# Altium project Nucleo Shield.PrjPcb
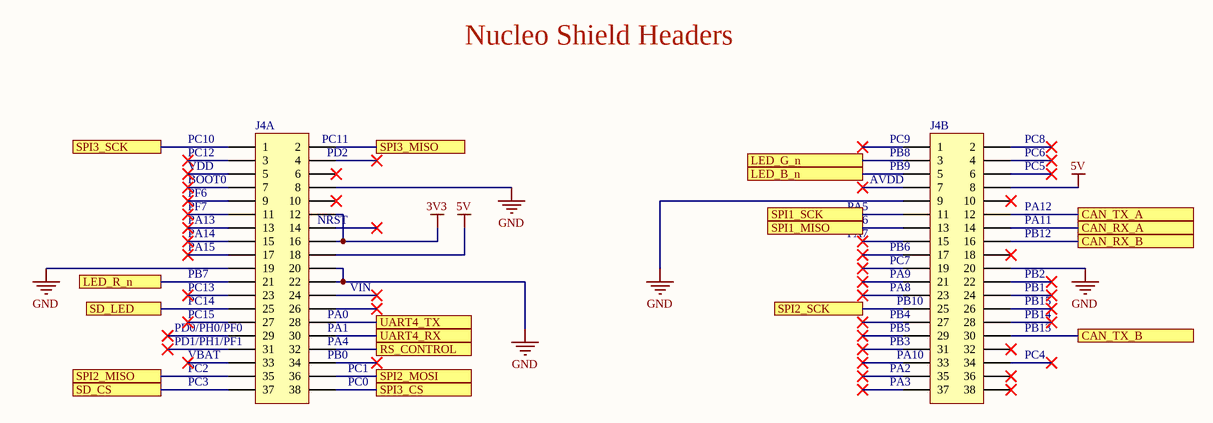
[diagram p0: SH1 - NUCLEO HEADERS.SchDoc]
6 sheets, 39 parts. Net scope: flat (ports and power ports of the same name join across sheets).
Board file: Nucleo Shield.PcbDoc
Sheets:
  SH1 - NUCLEO HEADERS.SchDoc
  SH2 - CAN.SchDoc
  SH3 - RS-485.SchDoc
  SH4 - SD CARD.SchDoc
  SH5 - RGB LED.SchDoc
  SH6 - BROADCOM ENCODER.SchDoc

## Sheet SH1 - NUCLEO HEADERS.SchDoc: Nucleo Headers
size B; CheckedBy: Wolfgang Windholtz; Engineer: Sahil Kale; Revision: 1; SheetNumber: 1; SheetTotal: 6

### Parts
J4  HEADER_NUCLEO  [HEADER_NUCLEO]  (value not drawn)  (parts A,B of 2)

### Ports
CAN_RX_A, CAN_RX_B, CAN_TX_A, CAN_TX_B, LED_B_n, LED_G_n, LED_R_n, RS_CONTROL, SD_CS, SD_LED, SPI1_MISO, SPI1_SCK, SPI2_MISO, SPI2_MOSI, SPI2_SCK, SPI3_CS, SPI3_MISO, SPI3_SCK, UART4_RX, UART4_TX

### Nets
3V3: J4.12 J4.16
5V: J4.18 J4.46(8)
GND: J4.8 J4.19 J4.20 J4.22 J4.47(9) J4.58(20)
NetJ3_1: J4.37 ; port SD_CS
NetJ3_2: J4.36 ; port SPI2_MOSI
NetJ3_5: J4.63(25) ; port SPI2_SCK
NetJ3_7: J4.35 ; port SPI2_MISO
NetJ4_1: J4.1 ; port SPI3_SCK
NetJ4_2: J4.2 ; port SPI3_MISO
NetJ4_21: J4.21 ; port LED_R_n
NetJ4_25: J4.25 ; port SD_LED
NetJ4_28: J4.28 ; port UART4_TX
NetJ4_30: J4.30 ; port UART4_RX
NetJ4_32: J4.32 ; port RS_CONTROL
NetJ4_38: J4.38 ; port SPI3_CS
NetJ4_41: J4.41(3) ; port LED_G_n
NetJ4_43: J4.43(5) ; port LED_B_n
NetJ4_49: J4.49(11) ; port SPI1_SCK
NetJ4_50: J4.50(12) ; port CAN_TX_A
NetJ4_51: J4.51(13) ; port SPI1_MISO
NetJ4_52: J4.52(14) ; port CAN_RX_A
NetJ4_54: J4.54(16) ; port CAN_RX_B
NetJ4_68: J4.68(30) ; port CAN_TX_B

Not connected (* = marked no-connect by the designer): J4 3* 4* 5* 6* 7* 9* 10* 11* 13* 14* 15* 17* 23* 24* 26* 27* 29* 31* 33* 34* 39(1)* 40(2)* 42(4)* 44(6)* 45(7)* 48(10)* 53(15)* 55(17)* 56(18)* 57(19)* 59(21)* 60(22)* 61(23)* 62(24)* 64(26)* 65(27)* 66(28)* 67(29)* 69(31)* 70(32)* 71(33)* 72(34)* 73(35)* 74(36)* 75(37)* 76(38)*

### Notes on the sheet
- Nucleo Shield Headers
- (near J4) PC10
- (near J4) PC12
- (near J4) BOOT0
- (near J4) VDD
- (near J4) PC11
- (near J4) PD2
- (near J4) AVDD
- (near J4) PC9
- (near J4) PB8
- (near J4) PB9
- (near J4) PC8
- (near J4) PC6
- (near J4) PC5
- (near J4) PF7
- (near J4) PF6
- (near J4) PA13
- (near J4) PA14
- (near J4) NRST
- (near J4) PA5
- (near J4) PA6
- (near J4) PA7
- (near J4) PA12
- (near J4) PA11
- (near J4) PB12
- (near J4) PA15
- (near J4) PB7
- (near J4) PC13
- (near J4) PC14
- (near J4) PC15
- (near J4) PA0
- (near J4) VIN
- (near J4) PB6
- (near J4) PC7
- (near J4) PA9
- (near J4) PA8
- (near J4) PB4
- (near J4) PB10
- (near J4) PB1
- (near J4) PB2
- (near J4) PB15
- (near J4) PB14
- (near J4) PD0/PH0/PF0
- (near J4) PD1/PH1/PF1
- (near J4) PC2
- (near J4) VBAT
- (near J4) PA1
- (near J4) PA4
- (near J4) PB0
- (near J4) PC1
- (near J4) PB5
- (near J4) PB3
- (near J4) PA2
- (near J4) PA10
- (near J4) PC4
- (near J4) PB13
- (near J4) PC3
- (near J4) PC0
- (near J4) PA3
- Title:
- Project:
- Date:
- Rev:
- Checker:
- Engineer:
- Sheet:
- of

### Library data of the parts
J4 = HEADER_NUCLEO: CONN HDR 38POS 0.1 GOLD PCB; Manufacturer 1: Sullins; Manufacturer Part Number 1: PPPC192LFBN-RC; Package/Footprint: TH; Supplier 1: Digi-Key; Supplier Part Number 1: S7122-ND; Mounting Type: TH; Verified: No; LCSC Part #: *

## Sheet SH2 - CAN.SchDoc: CAN Transceivers
size B; CheckedBy: Wolfgang Windholtz; Engineer: Sahil Kale; Revision: 1; SheetNumber: 2; SheetTotal: 6
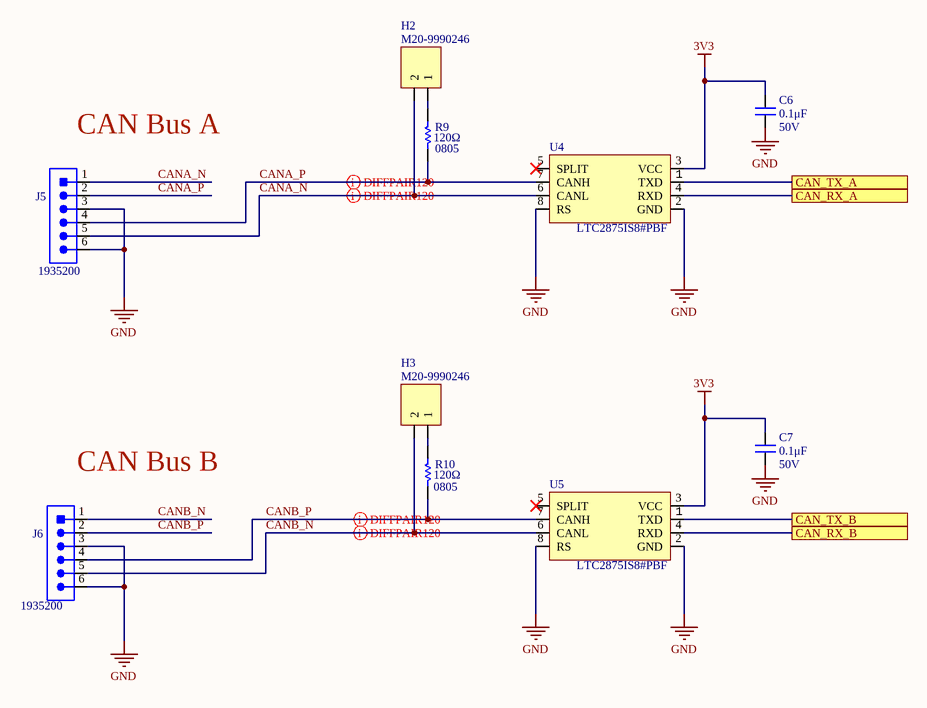
[diagram p1: SH2 - CAN.SchDoc]

### Parts
C6  value 0.1μF  Voltage Rating: 50V  [CAP2012]  (hidden comment: CAP_0.1uF_50V_0805)
C7  value 0.1μF  Voltage Rating: 50V  [CAP2012]  (hidden comment: CAP_0.1uF_50V_0805)
H2  Manufacturer Part Number 1: M20-9990246  [HDR1X2]  (hidden comment: JUMPER)
H3  Manufacturer Part Number 1: M20-9990246  [HDR1X2]  (hidden comment: JUMPER)
J5  CON_6POS_SCREW_TERM  [1935200]  (value not drawn)
J6  CON_6POS_SCREW_TERM  [1935200]  (value not drawn)
R9  value 120Ω  Package/Footprint: 0805  [RESC0805]  (hidden comment: RES_120Ω_0805_1%)
R10  value 120Ω  Package/Footprint: 0805  [RESC0805]  (hidden comment: RES_120Ω_0805_1%)
U4  Manufacturer Part Number 1: LTC2875IS8#PBF  [LT-S8_N]  (hidden comment: IC_CAN_TRANSCEIVER)
U5  Manufacturer Part Number 1: LTC2875IS8#PBF  [LT-S8_N]  (hidden comment: IC_CAN_TRANSCEIVER)

### Ports
CAN_RX_A, CAN_RX_B, CAN_TX_A, CAN_TX_B

### Nets
3V3: C6.1 C7.1 U4.3(VCC) U5.3(VCC)
GND: C6.2 C7.2 J5.3 J5.6 J6.3 J6.6 U4.2(GND) U4.8(RS) U5.2(GND) U5.8(RS)
CANA_N: H2.2 J5.1 J5.5 U4.6(CANL)
CANA_P: J5.2 J5.4 R9.1 U4.7(CANH)
CANB_N: H3.2 J6.1 J6.5 U5.6(CANL)
CANB_P: J6.2 J6.4 R10.1 U5.7(CANH)
NetH2_1: H2.1 R9.2
NetH3_1: H3.1 R10.2
NetJ4_50: U4.1(TXD) ; port CAN_TX_A
NetJ4_52: U4.4(RXD) ; port CAN_RX_A
NetJ4_54: U5.4(RXD) ; port CAN_RX_B
NetJ4_68: U5.1(TXD) ; port CAN_TX_B

Not connected (* = marked no-connect by the designer): U4 5(SPLIT)*; U5 5(SPLIT)*

### Layout directives
differential pair: CANA_N, CANA_P, CANB_N, CANB_P

### Notes on the sheet
- (near J5) CAN Bus A
- (near J6) CAN Bus B
- Title:
- Project:
- Date:
- Rev:
- Checker:
- Engineer:
- Sheet:
- of

### Library data of the parts
C6 C7 = CAP_0.1uF_50V_0805: CAP CER 0.1UF 50V X7R 0805; Manufacturer Part Number 1: GCM21BR71H104KA37K; Manufacturer 1: Murata Electronics; Package/Footprint: 0805; Supplier Part Number 1: 490-8049-1-ND; Supplier 1: Digi-Key; Dielectric: X7R; Mounting Type: SMD; LCSC Part #: C49678
H2 H3 = JUMPER: HEADER 2X1; Manufacturer 1: Harwin Inc.; Package/Footprint: TH; Supplier 1: Digi-Key; Supplier Part Number 1: 952-2262-ND; Mounting Type: TH
J5 J6 = CON_6POS_SCREW_TERM: TERM BLK 6POS SIDE ENTRY 5MM; Manufacturer 1: Phoenix Contact; Package/Footprint: TH; Wire Gauge: 12-26AWG; Screw Thread: M2.6; Supplier 1: Digi-Key; Supplier Part Number 1: 277-1581-ND; Mounting Type: TH; Pitch: 5mm; Manufacturer Part Number 1: 1935200
R9 R10 = RES_120Ω_0805_1%: RES 120 OHM 1% 1/8W 0805; Manufacturer 1: Vishay; Manufacturer Part Number 1: CRCW0805120RFKEA; Supplier Part Number 1: 541-120CCT-ND; Supplier 1: Digi-Key; Mounting Type: SMD; LCSC Part #: C17437
U4 U5 = IC_CAN_TRANSCEIVER: IC TXRX CAN 4MBPS 8SO; Manufacturer 1: Linear Technologies; Package/Footprint: 8-SOIC; Supplier Part Number 1: LTC2875IS8#PBF-ND; Supplier 1: Digi-Key; Mounting Type: SMD; LCSC Part #: C117076

## Sheet SH3 - RS-485.SchDoc: RS-485 Transceiver
size B; CheckedBy: Wolfgang Windholtz; Engineer: Sahil Kale; Revision: 1; SheetNumber: 3; SheetTotal: 6
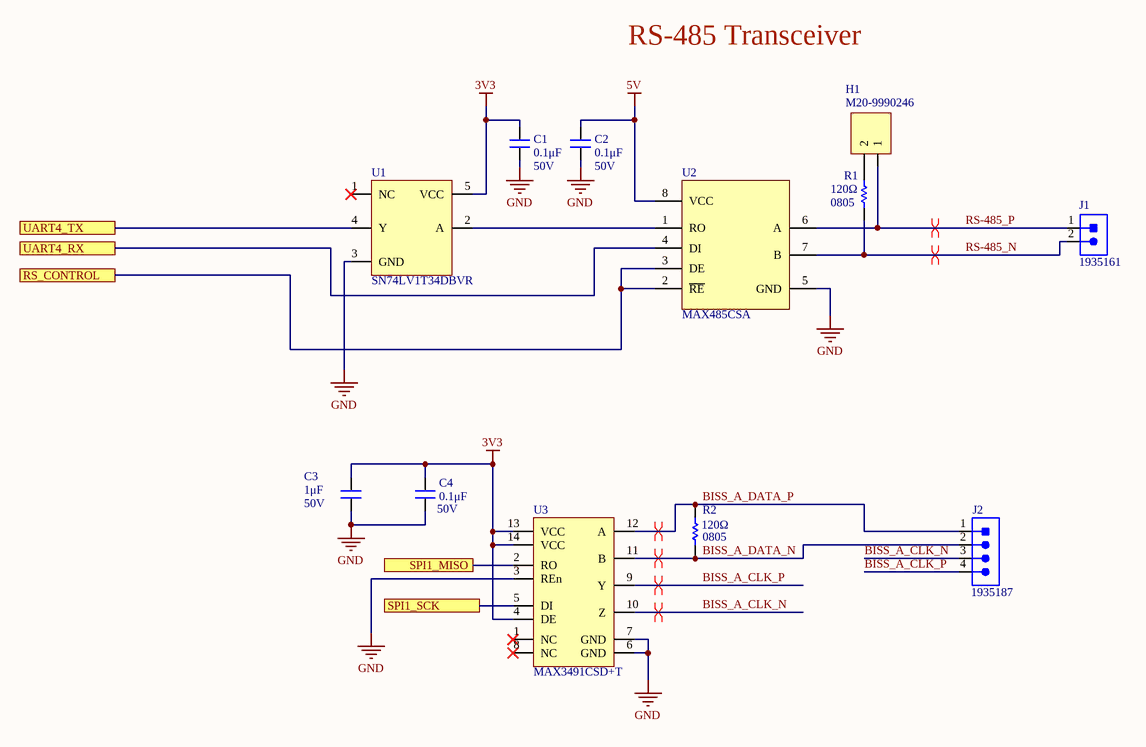
[diagram p2: SH3 - RS-485.SchDoc]

### Parts
C1  value 0.1μF  Voltage Rating: 50V  [CAP2012]  (hidden comment: CAP_0.1uF_50V_0805)
C2  value 0.1μF  Voltage Rating: 50V  [CAP2012]  (hidden comment: CAP_0.1uF_50V_0805)
C3  value 1μF  Voltage Rating: 50V  [CAP2012]  (hidden comment: CAP_1uF_50V_0805)
C4  value 0.1μF  Voltage Rating: 50V  [CAP2012]  (hidden comment: CAP_0.1uF_50V_0805)
H1  Manufacturer Part Number 1: M20-9990246  [HDR1X2]  (hidden comment: JUMPER)
J1  CON_2POS_SCREW_TERM  [1935161]  (value not drawn)
J2  CON_4POS_SCREW_TERM  [1935187]  (value not drawn)
R1  value 120Ω  Package/Footprint: 0805  [RESC0805]  (hidden comment: RES_120Ω_0805_1%)
R2  value 120Ω  Package/Footprint: 0805  [RESC0805]  (hidden comment: RES_120Ω_0805_1%)
U1  IC_BUFFER  [SN74LV1T34DBVR]  (value not drawn)
U2  MAX485CSA  [SOIC127P600X175-8N]
U3  MAX3491  [MAX3491CSD+T]  (value not drawn)

### Ports
RS_CONTROL, SPI1_MISO, SPI1_SCK, UART4_RX, UART4_TX

### Nets
3V3: C1.1 C3.2 C4.2 U1.5(VCC) U3.4(DE) U3.13(VCC) U3.14(VCC)
5V: C2.1 U2.8(VCC)
GND: C1.2 C2.2 C3.1 C4.1 U1.3(GND) U2.5(GND) U3.3(REn) U3.6(GND) U3.7(GND)
BISS_A_CLK_N: J2.3 U3.10(Z)
BISS_A_CLK_P: J2.4 U3.9(Y)
BISS_A_DATA_N: J2.2 R2.1 U3.11(B)
BISS_A_DATA_P: J2.1 R2.2 U3.12(A)
RS-485_N: J1.2 R1.1 U2.7(B)
RS-485_P: H1.1 J1.1 U2.6(A)
NetH1_2: H1.2 R1.2
NetJ4_28: U1.4(Y) ; port UART4_TX
NetJ4_30: U2.4(DI) ; port UART4_RX
NetJ4_32: U2.2(~{RE}) U2.3(DE) ; port RS_CONTROL
NetJ4_49: U3.5(DI) ; port SPI1_SCK
NetJ4_51: U3.2(RO) ; port SPI1_MISO
NetU1_2: U1.2(A) U2.1(RO)

Not connected (* = marked no-connect by the designer): U1 1(NC)*; U3 1(NC)* 8(NC)*

### Layout directives
differential pair: BISS_A_CLK_N, BISS_A_CLK_P, BISS_A_DATA_N, BISS_A_DATA_P, RS-485_N, RS-485_P

### Notes on the sheet
- RS-485 Transceiver
- Title:
- Project:
- Date:
- Rev:
- Checker:
- Engineer:
- Sheet:
- of

### Library data of the parts
C1 C2 C4 = CAP_0.1uF_50V_0805: as C6 on sheet SH2 - CAN; Supplier Part Number 1: 490-8049-1-ND; Supplier 1: Digi-Key; Dielectric: X7R; Mounting Type: SMD; LCSC Part #: C49678
C3 = CAP_1uF_50V_0805: CAP CER 1UF 50V X7R 0805; Manufacturer 1: Samsung Electro-Mechanics; Manufacturer Part Number 1: CL21B105KBFNNNG; Package/Footprint: 0805; Supplier 1: Digi-Key; Supplier Part Number 1: 1276-6470-1-ND; Mounting Type: SMD; LCSC Part #: C28323
H1 = JUMPER: as H2 on sheet SH2 - CAN; Supplier 1: Digi-Key; Supplier Part Number 1: 952-2262-ND; Mounting Type: TH
J1 = CON_2POS_SCREW_TERM: TERM BLK 2POS SIDE ENTRY 5MM; Manufacturer 1: Phoenix Contact; Package/Footprint: SMD; Supplier 1: Digi-Key; Mounting Type: TH; Supplier Part Number 1: 277-1667-ND; Manufacturer Part Number 1: 1935161
J2 = CON_4POS_SCREW_TERM: TERM BLK 4POS SIDE ENTRY 5MM; Manufacturer 1: Phoenix Contact; Package/Footprint: TH; Wire Gauge: 12-26AWG; Screw Thread: M2.6; Supplier 1: Digi-Key; Mounting Type: TH; Supplier Part Number 1: 277-1579-ND; Manufacturer Part Number 1: 1935187; Pitch: 5mm
R1 R2 = RES_120Ω_0805_1%: as R9 on sheet SH2 - CAN; Supplier Part Number 1: 541-120CCT-ND; Supplier 1: Digi-Key; Mounting Type: SMD; LCSC Part #: C17437
U1 = IC_BUFFER: IC BUF NON-INVERT 5.5V SOT23-5; Manufacturer 1: Texas Instruments; Package/Footprint: SOT-23-5; Supplier 1: Digi-Key; Supplier Part Number 1: 296-37176-1-ND; Manufacturer Part Number 1: SN74LV1T34DBVR; Mounting Type: SMD; LCSC Part #: C100024
U2 = MAX485CSA: IC RS485 TRANSCEIVER HALF 1/1 8SOIC; Manufacturer 1: Maxim Integrated; Manufacturer Part Number 1: MAX485CSA+T; Protocol: RS422, RS485; Data Rate: 2.5Mbps; Supply Voltage: 4.75V - 5.25V; Package/Footprint: 8-SOIC; Supplier 1: Digi-Key; Supplier Part Number 1: MAX485CSA+TCT-ND; Mounting Type: SMD; LCSC Part #: C9945
U3 = MAX3491: IC RS485 TRANSCEIVER FULL 1/1 14SOIC; Manufacturer 1: Maxim; Package/Footprint: 14-SOIC; Supplier 1: Digi-Key; Supplier Part Number 1: MAX3491CSD+CT-ND; Manufacturer Part Number 1: MAX3491CSD+T; Mounting Type: SMD

## Sheet SH4 - SD CARD.SchDoc: SD Card Interface
size B; CheckedBy: Wolfgang Windholtz; Engineer: Cindy Li; Revision: 1; SheetNumber: 4; SheetTotal: 6
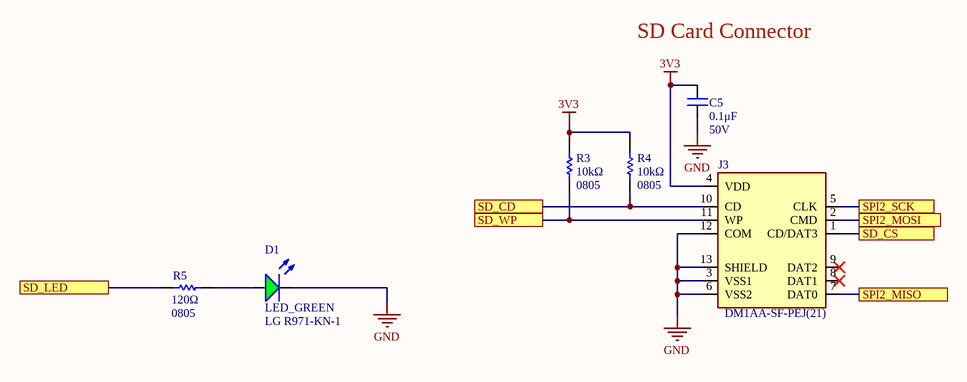
[diagram p3: SH4 - SD CARD.SchDoc]

### Parts
C5  value 0.1μF  Voltage Rating: 50V  [CAP2012]  (hidden comment: CAP_0.1uF_50V_0805)
D1  LED_GREEN  Manufacturer Part Number 1: LG R971-KN-1  [LED_0805_GREEN]
J3  Manufacturer Part Number 1: DM1AA-SF-PEJ(21)  [HRS_DM1AA-SF-PEJ(21)]  (hidden comment: CON_SD_CARD)
R3  value 10kΩ  Package/Footprint: 0805  [RES0805]  (hidden comment: RES_10kΩ_0805_5%)
R4  value 10kΩ  Package/Footprint: 0805  [RES0805]  (hidden comment: RES_10kΩ_0805_5%)
R5  value 120Ω  Package/Footprint: 0805  [RESC0805]  (hidden comment: RES_120Ω_0805_1%)

### Ports
SD_CD, SD_CS, SD_LED, SD_WP, SPI2_MISO, SPI2_MOSI, SPI2_SCK

### Nets
3V3: C5.2 J3.4(VDD) R3.2 R4.2
GND: C5.1 D1.2(K) J3.3(VSS1) J3.6(VSS2) J3.12(COM) J3.13(SHIELD)
NetD1_1: D1.1(A) R5.2
NetJ3_1: J3.1(CD/DAT3) ; port SD_CS
NetJ3_2: J3.2(CMD) ; port SPI2_MOSI
NetJ3_5: J3.5(CLK) ; port SPI2_SCK
NetJ3_7: J3.7(DAT0) ; port SPI2_MISO
NetJ3_10: J3.10(CD) R4.1 ; port SD_CD
NetJ3_11: J3.11(WP) R3.1 ; port SD_WP
NetJ4_25: R5.1 ; port SD_LED

Not connected (* = marked no-connect by the designer): J3 8(DAT1)* 9(DAT2)*

### Notes on the sheet
- SD Card Connector
- Title:
- Project:
- Date:
- Rev:
- Checker:
- Engineer:
- Sheet:
- of

### Library data of the parts
C5 = CAP_0.1uF_50V_0805: CAP CER 0.1UF 50V X7R 0805; Manufacturer 1: Murata Electronics; Manufacturer Part Number 1: GCM21BR71H104KA37K; Package/Footprint: 0805; Dielectric: X7R; Supplier 1: Digi-Key; Supplier Part Number 1: 490-8049-1-ND; Mounting Type: SMD; LCSC Part #: C49678
D1 = LED_GREEN: LED GREEN DIFFUSED 0805 SMD; Manufacturer 1: OSRAM; Forward Voltage Drop: 2.2V; Package/Footprint: 0805; Supplier Part Number 1: 475-1410-1-ND; Supplier 1: Digi-Key; Mounting Type: SMD
J3 = CON_SD_CARD: CONN SD CARD PUSH-PUSH R/A SMD; Manufacturer 1: Hirose Electric Co Ltd; Supplier 1: Digi-Key; Supplier Part Number 1: HR845CT-ND
R3 R4 = RES_10kΩ_0805_5%: RES 10K OHM 5% 1/8W 0805; Manufacturer 1: Panasonic Electronic Components; Manufacturer Part Number 1: ERJ-6GEYJ103V; Supplier Part Number 1: P10KACT-ND; Supplier 1: Digi-Key; Mounting Type: SMD; LCSC Part #: C17414
R5 = RES_120Ω_0805_1%: as R9 on sheet SH2 - CAN; Supplier Part Number 1: 541-120CCT-ND; Supplier 1: Digi-Key; Mounting Type: SMD; LCSC Part #: C17437

## Sheet SH5 - RGB LED.SchDoc: RGB LED
size B; CheckedBy: Wolfgang Windholtz; Engineer: Sahil Kale; Revision: 1; SheetNumber: 5; SheetTotal: 6
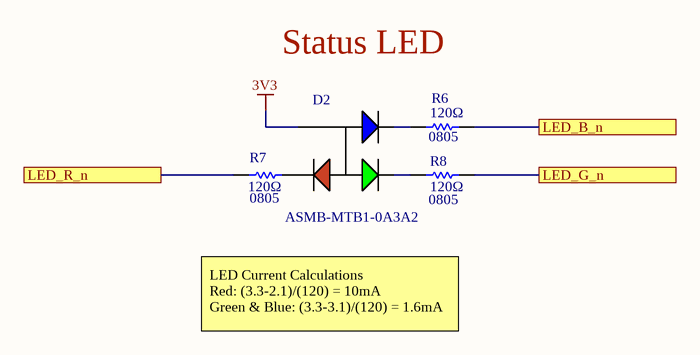
[diagram p4: SH5 - RGB LED.SchDoc]

### Parts
D2  Manufacturer Part Number 1: ASMB-MTB1-0A3A2  [LED_RGB]  (hidden comment: LED_RGB)
R6  value 120Ω  Package/Footprint: 0805  [RESC0805]  (hidden comment: RES_120Ω_0805_1%)
R7  value 120Ω  Package/Footprint: 0805  [RESC0805]  (hidden comment: RES_120Ω_0805_1%)
R8  value 120Ω  Package/Footprint: 0805  [RESC0805]  (hidden comment: RES_120Ω_0805_1%)

### Ports
LED_B_n, LED_G_n, LED_R_n

### Nets
3V3: D2.4(COMMON_ANODE)
NetD2_1: D2.1(CATHODE_(RED)) R7.2
NetD2_2: D2.2(CATHODE_(GREEN)) R8.1
NetD2_3: D2.3(CATHODE_(BLUE)) R6.1
NetJ4_21: R7.1 ; port LED_R_n
NetJ4_41: R8.2 ; port LED_G_n
NetJ4_43: R6.2 ; port LED_B_n

### Notes on the sheet
- Status LED
- LED Current Calculations
  Red: (3.3-2.1)/(120) = 10mA
  Green & Blue: (3.3-3.1)/(120) = 1.6mA
- Title:
- Project:
- Date:
- Rev:
- Checker:
- Engineer:
- Sheet:
- of

### Library data of the parts
D2 = LED_RGB: LED RGB DIFFUSED 4PLCC SMD; Manufacturer 1: Broadcom; Color: Blue,Green,Red; Lens Color: White; Viewing Angle: 115°; Lens Style: Round; Luminous Intensity: 350mcd; Dominant Wavelength: 470nm; Forward Voltage: 3.1V; Test Current: 20mA; Package/Footprint: 4-PLCC; Supplier 1: Digi-Key; Number of Pins: 4; Lens Transparency: Diffused; Supplier Part Number 1: 516-3280-1-ND; Mounting Type: SMD
R6-R8 = RES_120Ω_0805_1%: as R9 on sheet SH2 - CAN; Supplier Part Number 1: 541-120CCT-ND; Supplier 1: Digi-Key; Mounting Type: SMD; LCSC Part #: C17437

## Sheet SH6 - BROADCOM ENCODER.SchDoc: Broadcom Encoder
size B; CheckedBy: Wolfgang Windholtz; Engineer: Sahil Kale; Revision: 1; SheetNumber: 6; SheetTotal: 6
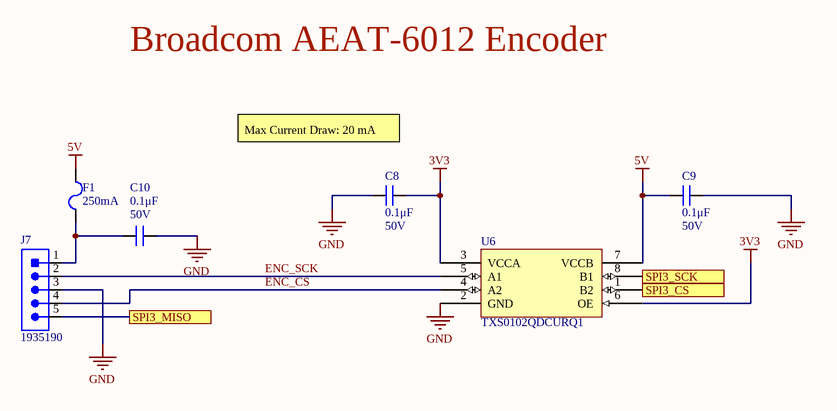
[diagram p5: SH6 - BROADCOM ENCODER.SchDoc]

### Parts
C8  value 0.1μF  Voltage Rating: 50V  [CAP2012]  (hidden comment: CAP_0.1uF_50V_0805)
C9  value 0.1μF  Voltage Rating: 50V  [CAP2012]  (hidden comment: CAP_0.1uF_50V_0805)
C10  value 0.1μF  Voltage Rating: 50V  [CAP2012]  (hidden comment: CAP_0.1uF_50V_0805)
F1  Current Rating: 250mA  [FUSE_1206]  (hidden comment: FUSE_250mA_1206)
J7  CON_5POS_SCREW_TERM  [1935190]  (value not drawn)
U6  IC_LVL_SHIFTER_2_CH  [TXS0102QDCURQ1]  (value not drawn)

### Ports
SPI3_CS, SPI3_MISO, SPI3_SCK

### Nets
3V3: C8.2 U6.3(VCCA) U6.6(OE)
5V: C9.1 F1.1 U6.7(VCCB)
GND: C8.1 C9.2 C10.1 J7.3 U6.2(GND)
ENC_CS: J7.4 U6.4(A2)
ENC_SCK: J7.2 U6.5(A1)
NetC10_2: C10.2 F1.2 J7.1
NetJ4_1: U6.8(B1) ; port SPI3_SCK
NetJ4_2: J7.5 ; port SPI3_MISO
NetJ4_38: U6.1(B2) ; port SPI3_CS

### Notes on the sheet
- Broadcom AEAT-6012 Encoder
- Max Current Draw: 20 mA
- Title:
- Project:
- Date:
- Rev:
- Reviewer:
- Engineer:
- Sheet:
- of

### Library data of the parts
C8 C9 = CAP_0.1uF_50V_0805: as C5 on sheet SH4 - SD CARD; Mounting Type: SMD; Supplier 1: Digi-Key; Supplier Part Number 1: 490-8049-1-ND; Dielectric: X7R; LCSC Part #: C49678
C10 = CAP_0.1uF_50V_0805: as C6 on sheet SH2 - CAN; Supplier Part Number 1: 490-8049-1-ND; Supplier 1: Digi-Key; Dielectric: X7R; Mounting Type: SMD; LCSC Part #: C49678
F1 = FUSE_250mA_1206: FUSE BOARD MNT 250MA 125VAC/VDC; Manufacturer 1: Littelfuse; Manufacturer Part Number 1: 0466.250NR; Package/Footprint: 1206; Supplier 1: Digi-Key; Supplier Part Number 1: F1452CT-ND; Mounting Type: SMD
J7 = CON_5POS_SCREW_TERM: TERM BLK 5POS SIDE ENTRY 5MM; Manufacturer 1: Phoenix Contact; Package/Footprint: TH; Supplier 1: Digi-Key; Mounting Type: TH; Supplier Part Number 1: 277-1580-ND; Manufacturer Part Number 1: 1935190
U6 = IC_LVL_SHIFTER_2_CH: IC TRNSLTR BIDIRECTIONAL US8; Manufacturer 1: Texas Instruments; Package Body Material: Plastic; Interface IC Type: INTERFACE CIRCUIT; Number of Functions: 1; Max Supply Voltage: 4.6V; Min Supply Voltage: -0.5V; Supply Voltage-Nom: 3.3V; Supplier 1: Digi-Key; RoHS: Yes; Category: Interface ICs; Stock 1: 25079; Pricing 1: 1=0.82000, 10=0.71900, 25=0.67600, 100=0.55150, 250=0.51232, 500=0.43600, 1000=0.34880 (USD); Package Code: VSSOP; Number of Pins: 8; Package Shape: Rectangular; Terminal Finish: Nickel; Min Operating Temperature: -40°C; Max Operating Temperature: 125°C; JESD-609 Code: e4; JESD-30 Code: R-PDSO-G8; Moisture Sensitivity Level: 2; Package Style: SMALL OUTLINE, VERY THIN PROFILE, SHRINK PITCHMeter; Peak Reflow Temperature (Cel): 260°C; Surface Mount: Yes; Terminal Form: Gull Wing; Terminal Position: DUAL; Length: 2.3mm; Width: 2mm; Height - Seated (Max): 0.9mm; Terminal Pitch: 0.5mm; Temperature Grade: AUTOMOTIVE; ComponentLink1URL: https://www.ti.com:443/lit/ds/symlink/txs0102-q1.pdf?src-supplier=IHS+Markit; ComponentLink1Description: https://www.ti.com:443/lit/ds/symlink/txs0102-q1.pdf?src-supplier=IHS+Markit; ComponentLink2URL: https://datasheet.ciiva.com/48438/txs0102-q1-48438266.pdf?src-supplier=Avnet; ComponentLink2Description: https://datasheet.ciiva.com/48438/txs0102-q1-48438266.pdf?src-supplier=Avnet; Supplier Part Number 1: 296-37938-1-ND; Manufacturer Part Number 1: TXS0102QDCURQ1

## Nets that join several sheets
3V3: SH1 - NUCLEO HEADERS (J4.12 J4.16), SH2 - CAN (C6.1 C7.1 U4.3 U5.3), SH3 - RS-485 (7 pins), SH4 - SD CARD (C5.2 J3.4 R3.2 R4.2), SH5 - RGB LED (D2.4), SH6 - BROADCOM ENCODER (C8.2 U6.3 U6.6)
5V: SH1 - NUCLEO HEADERS (J4.18 J4.46), SH3 - RS-485 (C2.1 U2.8), SH6 - BROADCOM ENCODER (C9.1 F1.1 U6.7)
GND: SH1 - NUCLEO HEADERS (6 pins), SH2 - CAN (10 pins), SH3 - RS-485 (9 pins), SH4 - SD CARD (6 pins), SH6 - BROADCOM ENCODER (5 pins)
NetJ3_1: SH1 - NUCLEO HEADERS (J4.37), SH4 - SD CARD (J3.1)
NetJ3_2: SH1 - NUCLEO HEADERS (J4.36), SH4 - SD CARD (J3.2)
NetJ3_5: SH1 - NUCLEO HEADERS (J4.63), SH4 - SD CARD (J3.5)
NetJ3_7: SH1 - NUCLEO HEADERS (J4.35), SH4 - SD CARD (J3.7)
NetJ4_1: SH1 - NUCLEO HEADERS (J4.1), SH6 - BROADCOM ENCODER (U6.8)
NetJ4_2: SH1 - NUCLEO HEADERS (J4.2), SH6 - BROADCOM ENCODER (J7.5)
NetJ4_21: SH1 - NUCLEO HEADERS (J4.21), SH5 - RGB LED (R7.1)
NetJ4_25: SH1 - NUCLEO HEADERS (J4.25), SH4 - SD CARD (R5.1)
NetJ4_28: SH1 - NUCLEO HEADERS (J4.28), SH3 - RS-485 (U1.4)
NetJ4_30: SH1 - NUCLEO HEADERS (J4.30), SH3 - RS-485 (U2.4)
NetJ4_32: SH1 - NUCLEO HEADERS (J4.32), SH3 - RS-485 (U2.2 U2.3)
NetJ4_38: SH1 - NUCLEO HEADERS (J4.38), SH6 - BROADCOM ENCODER (U6.1)
NetJ4_41: SH1 - NUCLEO HEADERS (J4.41), SH5 - RGB LED (R8.2)
NetJ4_43: SH1 - NUCLEO HEADERS (J4.43), SH5 - RGB LED (R6.2)
NetJ4_49: SH1 - NUCLEO HEADERS (J4.49), SH3 - RS-485 (U3.5)
NetJ4_50: SH1 - NUCLEO HEADERS (J4.50), SH2 - CAN (U4.1)
NetJ4_51: SH1 - NUCLEO HEADERS (J4.51), SH3 - RS-485 (U3.2)
NetJ4_52: SH1 - NUCLEO HEADERS (J4.52), SH2 - CAN (U4.4)
NetJ4_54: SH1 - NUCLEO HEADERS (J4.54), SH2 - CAN (U5.4)
NetJ4_68: SH1 - NUCLEO HEADERS (J4.68), SH2 - CAN (U5.1)